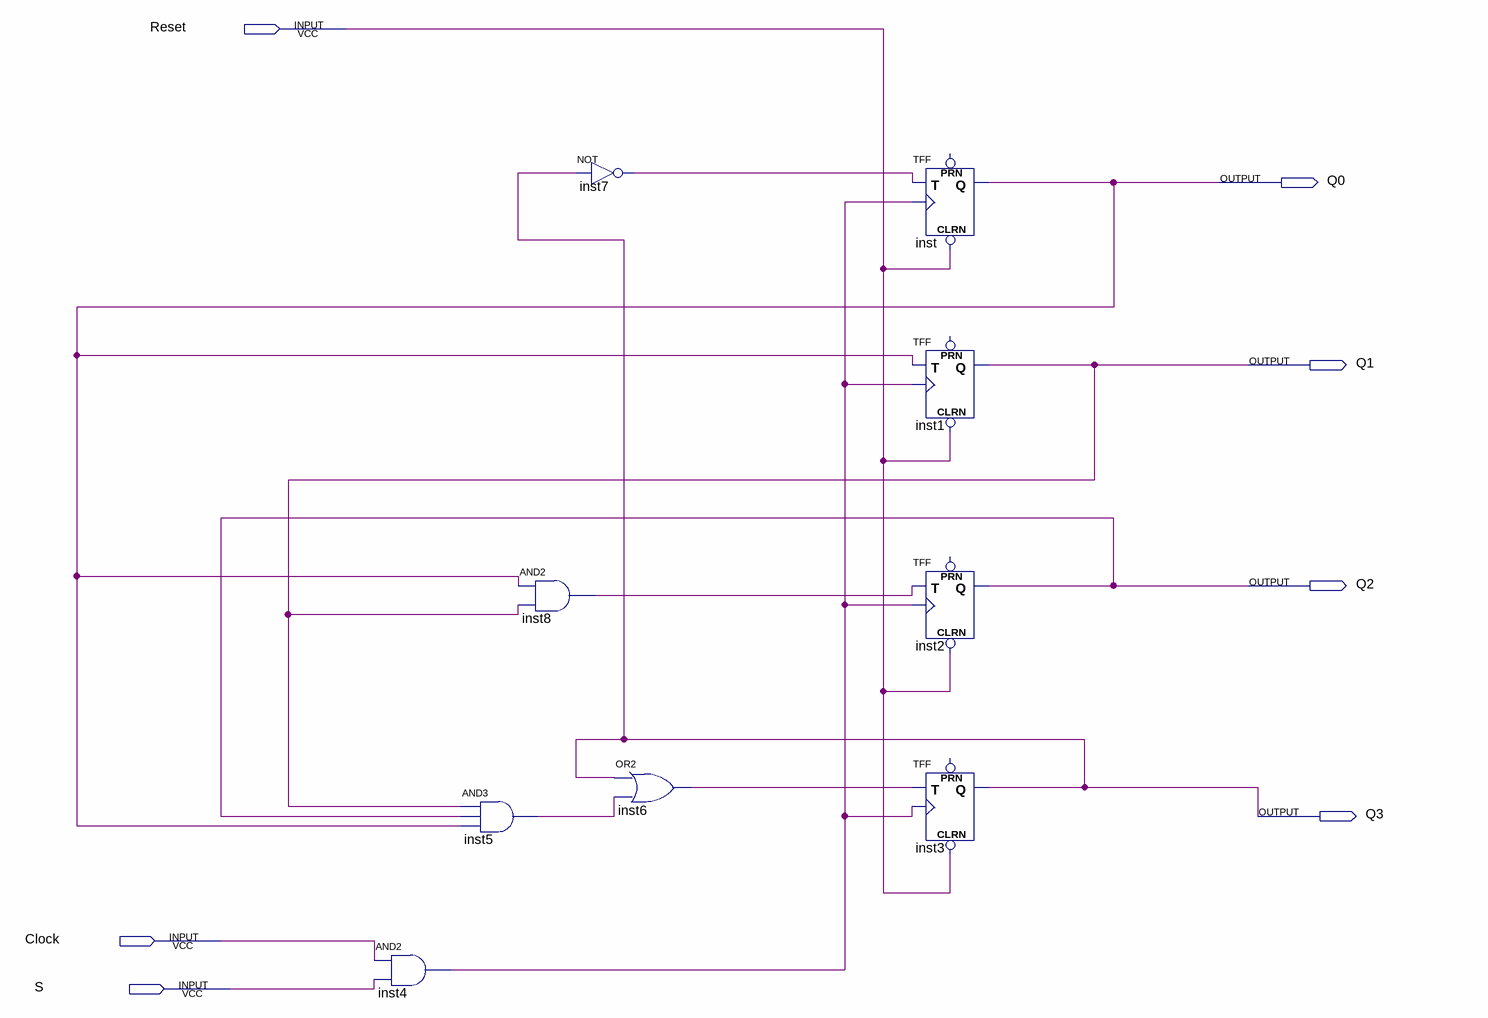
[diagram p0: schematic sheet]
// Quartus schematic SequentialCircuit.bdf as structural Verilog: 9 symbols, 7 pins
module SequentialCircuit (
  input  Reset,
  input  Clock,
  input  S,
  output Q0,
  output Q1,
  output Q2,
  output Q3
);

  wire inst4_out, inst5_out, inst6_out, inst7_out, inst8_out;

  and inst4 (inst4_out, Clock, S);
  and inst5 (inst5_out, Q1, Q2, Q0);
  and inst8 (inst8_out, Q0, Q1);
  not inst7 (inst7_out, Q3);
  or inst6 (inst6_out, Q3, inst5_out);
  TFF inst (.CLRN(Reset), .T(inst7_out), .CLK(inst4_out), .Q(Q0));  // open: PRN
  TFF inst1 (.CLRN(Reset), .T(Q0), .CLK(inst4_out), .Q(Q1));  // open: PRN
  TFF inst2 (.CLRN(Reset), .T(inst8_out), .CLK(inst4_out), .Q(Q2));  // open: PRN
  TFF inst3 (.CLRN(Reset), .T(inst6_out), .CLK(inst4_out), .Q(Q3));  // open: PRN
endmodule
